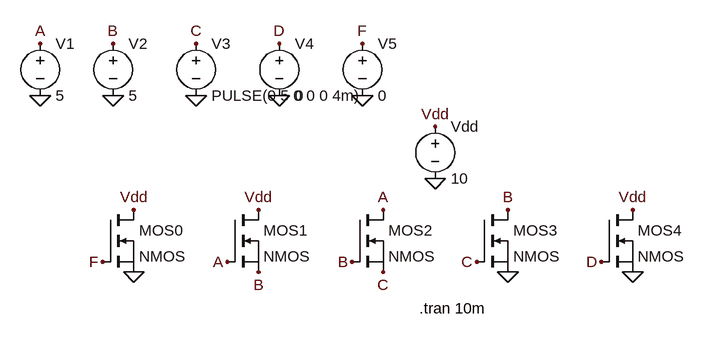
[diagram p0: schematic Output2Simulation.asc]
Output2Simulation.asc, the LTspice schematic file:
Version 4
SHEET 1 960 720
FLAG 32 -144 Vdd
FLAG -16 -64 F
FLAG 32 -48 0
FLAG 224 -144 Vdd
FLAG 176 -64 A
FLAG 224 -48 B
FLAG 416 -144 A
FLAG 368 -64 B
FLAG 416 -48 C
FLAG 608 -144 B
FLAG 560 -64 C
FLAG 608 -48 0
FLAG 800 -144 Vdd
FLAG 752 -64 D
FLAG 800 -48 0
FLAG 496 -192 0
FLAG 496 -272 Vdd
FLAG -112 -400 A
FLAG 0 -400 B
FLAG 128 -400 C
FLAG 256 -400 D
FLAG 384 -400 F
FLAG 384 -320 0
FLAG 256 -320 0
FLAG 128 -320 0
FLAG 0 -320 0
FLAG -112 -320 0
SYMBOL nmos -16 -144 R0
SYMATTR InstName MOS0
SYMBOL nmos 176 -144 R0
SYMATTR InstName MOS1
SYMBOL nmos 368 -144 R0
SYMATTR InstName MOS2
SYMBOL nmos 560 -144 R0
SYMATTR InstName MOS3
SYMBOL nmos 752 -144 R0
SYMATTR InstName MOS4
SYMBOL voltage 496 -288 R0
SYMATTR InstName Vdd
SYMATTR Value 10
SYMBOL voltage -112 -416 R0
SYMATTR InstName V1
SYMATTR Value 5
SYMBOL voltage 0 -416 R0
SYMATTR InstName V2
SYMATTR Value 5
SYMBOL voltage 128 -416 R0
SYMATTR InstName V3
SYMATTR Value PULSE(0 5 0 0 0 4m)
SYMBOL voltage 256 -416 R0
SYMATTR InstName V4
SYMATTR Value 0
SYMBOL voltage 384 -416 R0
SYMATTR InstName V5
SYMATTR Value 0
TEXT 472 8 Left 2 !.tran 10m

The netlist it stands for:
* Output2Simulation.asc
MOS0 Vdd F 0 0 NMOS
MOS1 Vdd A B B NMOS
MOS2 A B C C NMOS
MOS3 B C 0 0 NMOS
MOS4 Vdd D 0 0 NMOS
Vdd Vdd 0 10
V1 A 0 5
V2 B 0 5
V3 C 0 PULSE(0 5 0 0 0 4m)
V4 D 0 0
V5 F 0 0
.model NMOS NMOS
.model PMOS PMOS
.lib standard.mos
.tran 10m
.backanno
.end